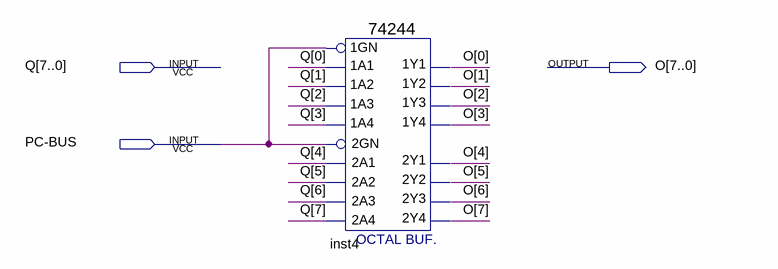
[diagram p0: schematic sheet]
// Quartus schematic PC_tri.bdf as structural Verilog: 1 symbols, 3 pins
module PC_tri (
  input  [7:0] Q,
  input  \PC-BUS ,
  output [7:0] O
);

  \74244  inst4 (
    .\1A2 (Q[1]), .\1A4 (Q[3]), .\1A1 (Q[0]), .\1A3 (Q[2]), .\1GN (\PC-BUS ), .\2A3 (Q[6]), .\2GN (\PC-BUS ),
    .\2A1 (Q[4]), .\2A4 (Q[7]), .\2A2 (Q[5]), .\1Y2 (O[1]), .\1Y4 (O[3]), .\2Y1 (O[4]), .\1Y1 (O[0]),
    .\2Y3 (O[6]), .\2Y4 (O[7]), .\1Y3 (O[2]), .\2Y2 (O[5]));
endmodule
